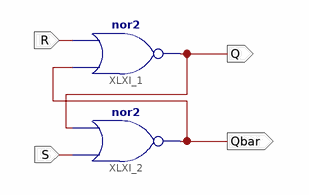
[diagram p0: schematic sheet 1]
// Xilinx ISE schematic SR_LATCH.sch (kintex7) as structural Verilog: 2 symbols, 4 ports
module SR_LATCH (
  input  R,
  input  S,
  output Q,
  output Qbar
);

  nor XLXI_1 (Q, Qbar, R);
  nor XLXI_2 (Qbar, S, Q);
endmodule
